# EAGLE design sensorfly_sensors (EAGLE 5.11)

## Sheet 1 of 2
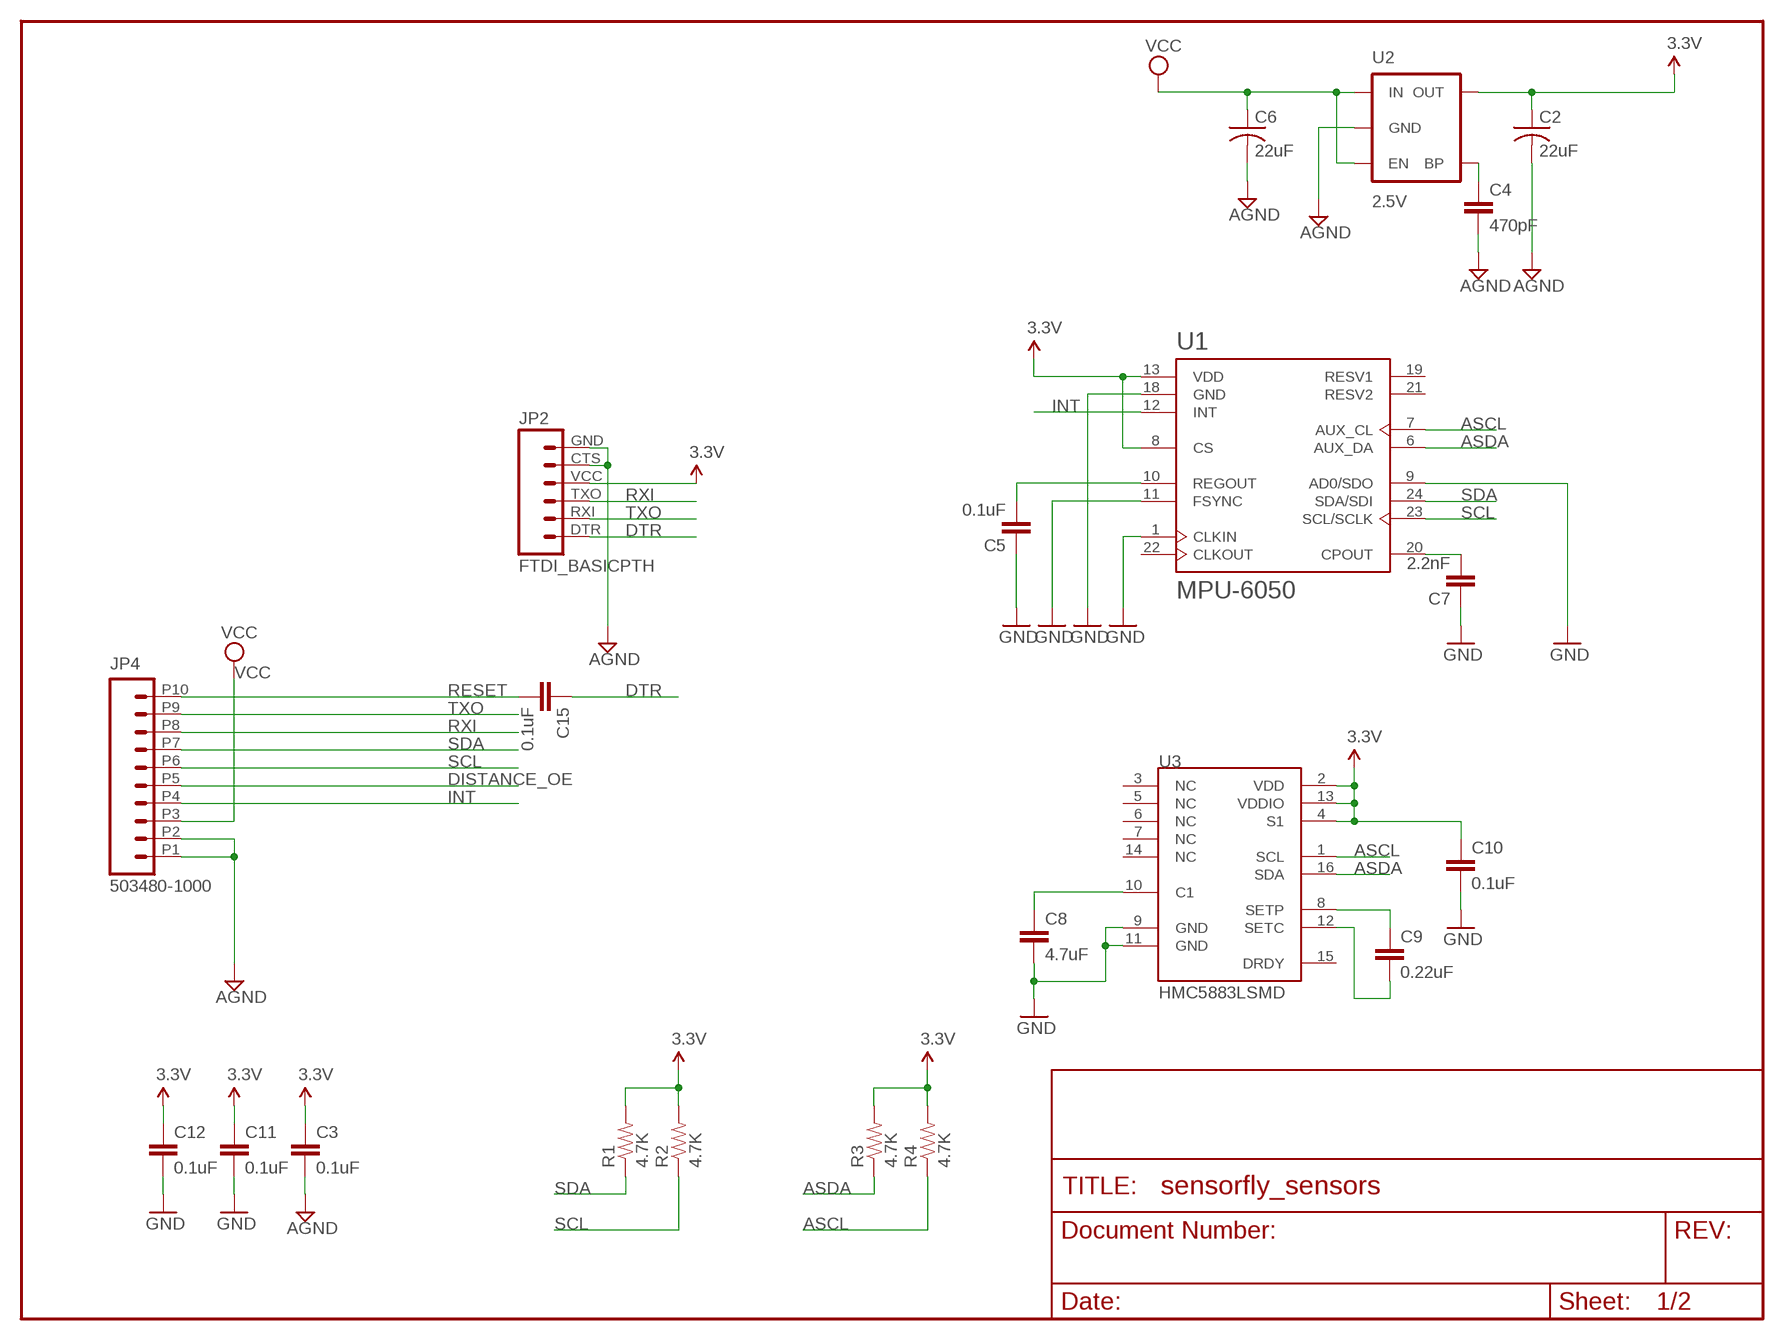
[diagram p0: schematic, sheet 1]

### Parts
C2  22uF  C-USC0805  [C0805]
C3  0.1uF  CAP0402-CAP  [0402-CAP]
C4  470pF  CAP0402-CAP  [0402-CAP]
C5  0.1uF  CAP0402-CAP  [0402-CAP]
C6  22uF  C-USC0805  [C0805]
C7  2.2nF  CAP0402-CAP  [0402-CAP]
C8  4.7uF  CAP0805  [0805]
C9  0.22uF  CAP0402-CAP  [0402-CAP]
C10  0.1uF  CAP0402-CAP  [0402-CAP]
C11  0.1uF  CAP0402-CAP  [0402-CAP]
C12  0.1uF  CAP0402-CAP  [0402-CAP]
C15  0.1uF  CAP0402-CAP  [0402-CAP]
JP2  FTDI_BASICPTH  [FTDI_BASIC]
JP4  503480-1000  [503480-1000]
R1  4.7K  RESISTOR0402-RES  [0402-RES]
R2  4.7K  RESISTOR0402-RES  [0402-RES]
R3  4.7K  RESISTOR0402-RES  [0402-RES]
R4  4.7K  RESISTOR0402-RES  [0402-RES]
U1  MPU-6050  MPU-6000  [QFN24MPU]
U2  2.5V  V_REG_LDOSMD  [SOT23-5]
U3  HMC5883LSMD  [16LPCC]

### Nets
3.3V: C2.1 C3.1 C10.1 C11.1 C12.1 JP2.VCC R1.2 R2.2 R3.2 R4.2 U1.8(CS) U1.13(VDD) U2.5(OUT) U3.2(VDD) U3.4(S1) U3.13(VDDIO) ; also sheet 2
AGND: C2.2 C3.2 C4.2 C6.2 JP2.CTS JP2.GND JP4.P1 JP4.P2 U2.2(GND) ; also sheet 2
ASCL: R4.1 U1.7(AUX_CL) U3.1(SCL)
ASDA: R3.1 U1.6(AUX_DA) U3.16(SDA)
DISTANCE_OE: JP4.P5 ; also sheet 2
DTR: C15.1 JP2.DTR
GND: C5.1 C7.1 C8.2 C10.2 C11.2 C12.2 U1.1(CLKIN) U1.9(AD0/SDO) U1.11(FSYNC) U1.18(GND) U3.9(GND) U3.11(GND)
INT: JP4.P4 U1.12(INT)
N$2: C4.1 U2.4(BP)
N$29: C7.2 U1.20(CPOUT)
N$30: C5.2 U1.10(REGOUT)
N$31: C8.1 U3.10(C1)
N$37: C9.1 U3.8(SETP)
N$38: C9.2 U3.12(SETC)
RESET: C15.2 JP4.P10
RXI: JP2.TXO JP4.P8 ; also sheet 2
SCL: JP4.P6 R2.1 U1.23(SCL/SCLK)
SDA: JP4.P7 R1.1 U1.24(SDA/SDI)
TXO: JP2.RXI JP4.P9 ; also sheet 2
VCC: C6.1 JP4.P3 U2.1(IN) U2.3(EN) ; also sheet 2
Unconnected: U1.19(RESV1) U1.21(RESV2) U1.22(CLKOUT) U3.3(NC) U3.5(NC) U3.6(NC) U3.7(NC) U3.14(NC) U3.15(DRDY)

## Sheet 2 of 2
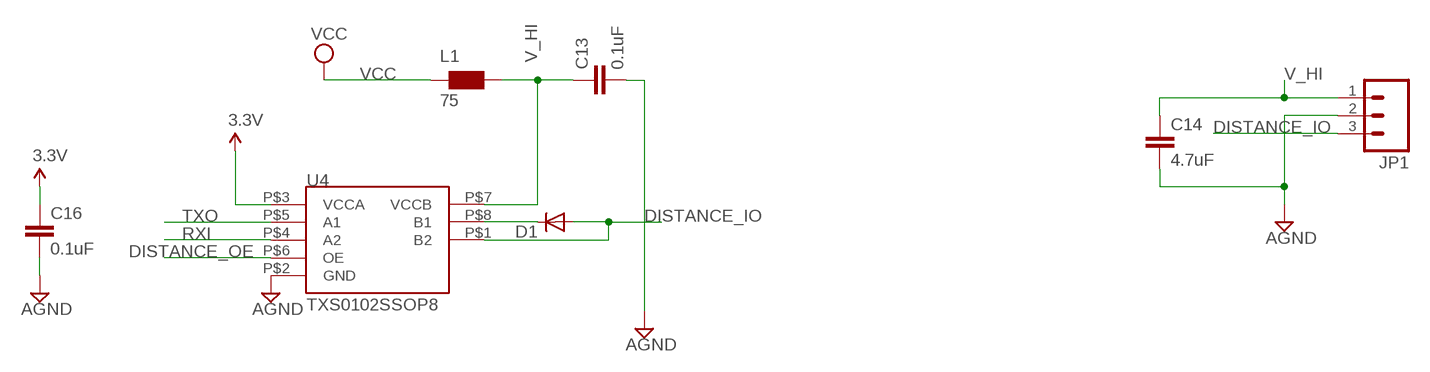
[diagram p1: schematic, sheet 2]

### Parts
C13  0.1uF  CAP0402-CAP  [0402-CAP]
C14  4.7uF  CAP0805  [0805]
C16  0.1uF  CAP0402-CAP  [0402-CAP]
D1  DIODESOD  [SOD-323]
JP1  M03PTH  [1X03]
L1  75  WE-KIHQ_0805  [WE-KI_0805_B]
U4  TXS0102SSOP8  [SSOP8]

### Nets
3.3V: C16.1 U4.P$3(VCCA) ; also sheet 1
AGND: C13.2 C14.2 C16.2 JP1.2 U4.P$2(GND) ; also sheet 1
DISTANCE_IO: D1.2(A) JP1.3 U4.P$1(B2)
DISTANCE_OE: U4.P$6(OE) ; also sheet 1
N$4: D1.1(C) U4.P$8(B1)
RXI: U4.P$4(A2) ; also sheet 1
TXO: U4.P$5(A1) ; also sheet 1
V_HI: C13.1 C14.1 JP1.1 L1.1 U4.P$7(VCCB)
VCC: L1.2 ; also sheet 1

## Library data of the parts
C2 C6 = rcl:C-US: CAPACITOR, American symbol
C3-C5 C7-C16 = SparkFun:CAP: Capacitor Standard 0603 ceramic capacitor, and 0.1" leaded capacitor.
D1 = SparkFun:DIODE: Diode These are standard reverse protection diodes and small signal diodes. SMA package can handle up to about 1A. SOD-323 can handle about 200mA. What the SOD-323 package when ordering, there are some mfgs out there that are 5-pin packages.
JP1 = SparkFun:M03: Header 3 Standard 3-pin 0.1" header. Use with straight break away headers (SKU : PRT-00116), right angle break away headers (PRT-00553), swiss pins (PRT-00743), machine pins (PRT-00117), and female headers (PRT-00115). Molex polarized connector foot print use with SKU : PRT-08232 with associated crimp pins and housings.
JP2 = SparkFun:FTDI_BASIC: FTDI Basic: 3.3V and 5V
JP4 = pei:503480-1000
L1 = wuerth-elektronik:WE-KIHQ: SMD Wire Wound Ceramic Inductor WE-KIHQ - High current - Highest Quality factor in size 0805 - up to 98 - High thermal stability - High SRF -- Bluetooth -- Wireless LAN -- RF oscillation circuit -- IF impedance matching -- IG choke
R1-R4 = SparkFun:RESISTOR: Resistor Basic schematic elements and footprints for 0603, 1206, and PTH resistors.
U1 = sf-invensense:MPU-6000
U2 = SparkFun:V_REG_LDO: Voltage Regulator LDO Standard 150mA LDO voltage regulator in SOT-23 layout. Micrel part MIC5205. BP (by-pass) pin is used to lower output noise with 470pF cap.
U3 = SparkFun:HMC5883L: 3 Axis Digital Compass IC
U4 = pei:TXS0102

## Net classes
0 default: width 0.152 mm, drill 0.152 mm, clearance 0.152 mm
1 power: width 0.254 mm, drill 0.305 mm, clearance 0.152 mm

## Board
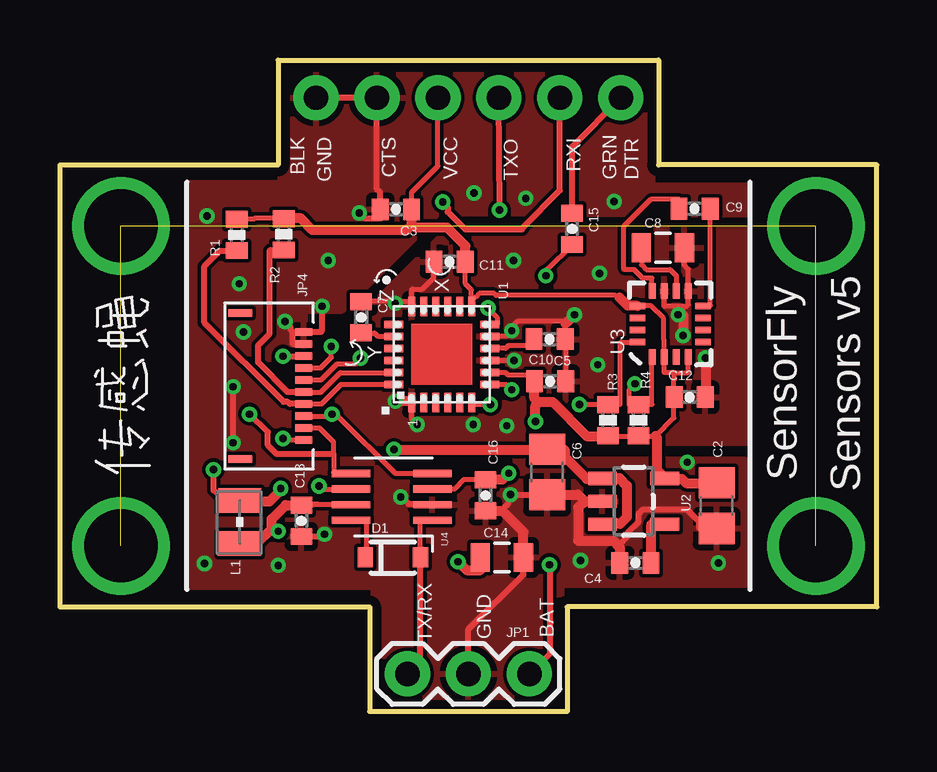
[diagram p2: board, top side]
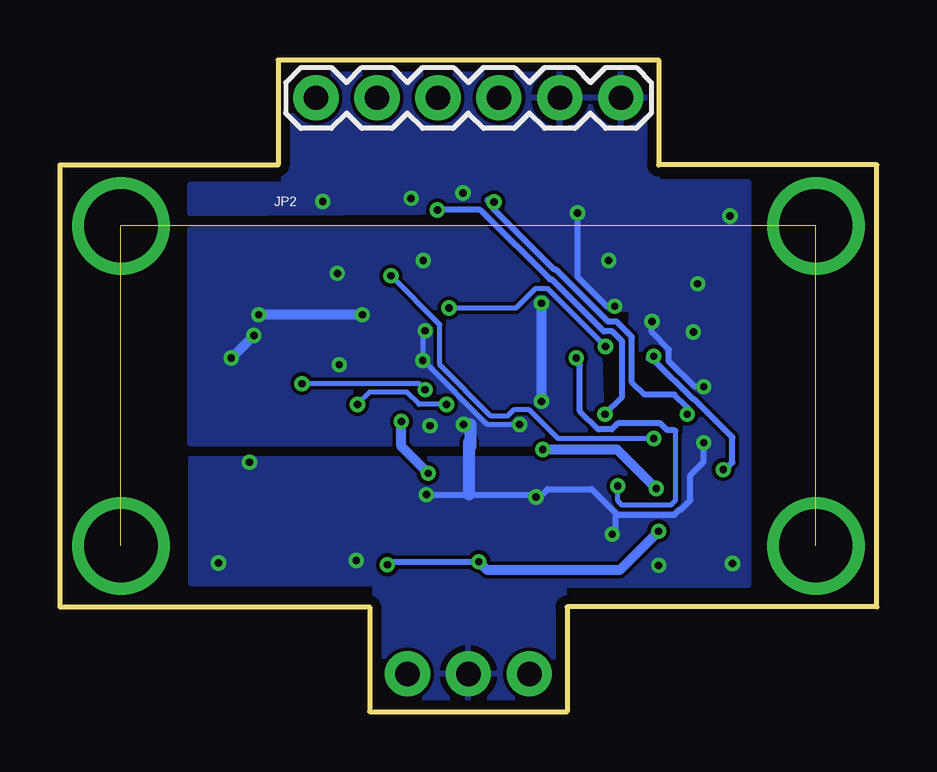
[diagram p3: board, bottom side, seen from below]

Size 34.04 x 27.15 mm. Coordinates in mm from the lower left corner, seen from the top.
Outline: 0,4.37 0,22.78 9.09,22.78 9.09,27.15 24.94,27.15 24.94,22.78 34.04,22.78 34.04,4.37 21.13,4.37 21.13,0 12.9,0 12.9,4.37 0,4.37
Copper layers (1*2+15*16): Top 0.0356mm / dielectric 1.5011mm / Route2 0.0356mm / dielectric 0.1499mm / Route15 0.0356mm / dielectric 0.2007mm / Bottom 0.0356mm
Design rules "typical_4pcb *": minimum track width 5mil, minimum drill 6mil, track to track 6mil, track to pad 6mil, pad to pad 7mil, via to via 7mil, smd to smd 6mil, copper to edge 15mil, drill to drill 8mil, minimum pad ring 10mil, minimum via ring 5mil, stop-mask expansion 4mil, vias tented up to drill 12mil, thermal gap 10mil

### Footprints (pad centres in the part's own frame; a part is rotated, then mirrored left to right if it is on the bottom)
C0805 = smd 1.3 x 1.5: 1 -0.95,0; 2 0.95,0
0402-CAP = smd 0.7 x 0.9: 1 -0.65,0; 2 0.65,0
0805 = smd 0.8 x 1.2: 1 -0.9,0; 2 0.9,0
SOD-323 = smd 0.63 x 0.83: 1 -1.15,0; 2 1.15,0
1X03 = drill 1.016 pad 1.88 round: 1 0,0; 2 2.54,0; 3 5.08,0
FTDI_BASIC = drill 1.016 pad 1.88 round: CTS 10.16,0; DTR 0,0; GND 12.7,0; RXI 2.54,0; TXO 5.08,0; VCC 7.62,0
503480-1000 = smd 0.3 x 0.7: P1 -2,0; P2 -1.5,0; P3 -1,0; P4 -0.5,0; P5 0,0; P6 0.5,0; P7 1,0; P8 1.5,0; P9 2,0; P10 2.5,0 | smd 0.3 x 1: P$11 -2.79,-2.65; P$12 3.29,-2.65
WE-KI_0805_B = smd 1.02 x 1.78: 1 -0.89,0; 2 0.89,0
0402-RES = smd 0.7 x 0.9: 1 -0.65,0; 2 0.65,0
QFN24MPU = smd 0.8 x 0.3: 1 -2,1.25; 2 -2,0.75; 3 -2,0.25; 4 -2,-0.25; 5 -2,-0.75; 6 -2,-1.25; 13 2,-1.25; 14 2,-0.75; 15 2,-0.25; 16 2,0.25; 17 2,0.75; 18 2,1.25 | smd 0.3 x 0.8: 7 -1.25,-2; 8 -0.75,-2; 9 -0.25,-2; 10 0.25,-2; 11 0.75,-2; 12 1.25,-2; 19 1.25,2; 20 0.75,2; 21 0.25,2; 22 -0.25,2; 23 -0.75,2; 24 -1.25,2
SOT23-5 = smd 0.55 x 1.2: 1 -0.95,-1.3; 2 0,-1.3; 3 0.95,-1.3; 4 0.95,1.3; 5 -0.95,1.3
16LPCC = smd 0.65 x 0.28: 1 -1.37,0.75; 2 -1.37,0.25; 3 -1.37,-0.25; 4 -1.37,-0.75; 9 1.37,-0.75; 10 1.37,-0.25; 11 1.37,0.25; 12 1.37,0.75 | smd 0.28 x 0.65: 5 -0.75,-1.37; 6 -0.25,-1.37; 7 0.25,-1.37; 8 0.75,-1.37; 13 0.75,1.37; 14 0.25,1.37; 15 -0.25,1.37; 16 -0.75,1.37
SSOP8 = smd 0.3 x 1.6: P$1 0,0; P$2 0.65,0; P$3 1.3,0; P$4 1.95,0; P$5 1.95,3.4; P$6 1.3,3.4; P$7 0.65,3.4; P$8 0,3.4

### Placement (x,y rotation side)
C2  27.36,8.59 270 top
C3  14,20.93 180 top
C4  23.98,6.2 180 top
C5  20.4,15.52 180 top
C6  20.29,9.98 270 top
C7  12.55,16.43 270 top
C8  25.12,19.33 0 top
C9  26.44,20.95 180 top
C10  20.42,13.77 0 top
C11  16.23,18.75 180 top
C12  26.24,13.11 0 top
C13  10.06,7.95 270 top
C14  18.41,6.43 0 top
C15  21.34,20.12 270 top
C16  17.73,9.02 270 top
D1  13.87,6.43 0 top
JP1  19.56,1.57 180 top
JP2  23.37,25.58 0 bottom
JP4  10.16,13.82 270 top
L1  7.49,7.9 90 top
R1  7.37,19.86 90 top
R2  9.32,19.89 90 top
R3  22.83,12.14 270 top
R4  24.1,12.14 270 top
U1  15.9,14.88 90 top
U2  23.9,8.76 270 top
U3  25.43,16.15 90 top
U4  15.52,7.98 90 top
U$2  [SENSORFLY_SMALLER]  2.54,13.72 90 top

### Tracks (layer width: path | path; a pad name or v marks a point on that pad's centre or on a via)
3.3V  (via drill 0.3 pad 0.64)
  Top 0.203: U1.8 17.91,14.12 18.57,14.12 18.67,14.02 19.77,14.02 C10.1 | C11.1 16.89,17.83 17.15,17.58 U1.13 17.22,17.25 17.32,17.27 17.48,17.42 18.09,17.42 18.16,17.35 23.14,17.35 23.32,17.25 | 25.6,14.12 25.2,14.12 25.17,14.15 U3.2 25.17,14.88 25.17,15.49 25.15,15.52 25.15,16.38 24.61,16.92 24.08,16.92 U3.13 | 25.6,14.12 26.16,14.12 26.19,14.15 U3.4 | 25.6,14.12 25.6,13.84 25.58,13.82 25.58,13.11 C12.1 25.58,13.03 25.58,12.24 24.82,11.48 R4.2 24.03,11.48 R3.2 | C16.1 16.84,9.68 16.46,9.3 16.26,9.3 16.23,9.27 U4.P$3 | R2.2 8.1,20.55 8.08,20.52 7.37,20.52 R1.2 | JP2.VCC 15.75,22.73 14.66,21.64 14.66,21.11 C3.1
  Top 0.406: C2.1 27.36,9.52 26.09,9.52 25.91,9.7 25.22,9.7 U2.5 25.07,9.88 24.87,10.08 24.87,11.4 24.82,11.48 | 19.91,12.9 20.52,12.9 21.95,11.48 22.76,11.48 R3.2 | 19.91,12.9 19.76,13.06 19.76,13.69 C10.1 | v19.81,12.09 19.81,12.73 19.91,12.9 | v18.69,9.93 18.44,9.68 17.8,9.68 C16.1 | 14.66,20.27 C3.1 | 14.66,20.27 14.45,20.07 10.52,20.07 10.03,20.55 9.4,20.55 R2.2 | C11.1 16.89,18.82 16.89,19.41 16.13,20.17 14.83,20.17 14.66,20.27 | 23.32,17.25 23.65,16.92 23.98,16.92 U3.13
  Bottom 0.406: v19.81,12.09 19.81,11.05 v18.69,9.93
AGND  (via drill 0.3 pad 0.64)
  Top 0.254: 9.68,15.82 JP4.P1 10.26,15.82 10.87,15.82 10.92,15.87 v10.92,16.89 | 9.68,15.82 9.68,15.34 9.7,15.32 JP4.P2 | C6.2 20.12,9.04 v18.77,9.04 18.69,8.94 18.69,8.69 18.54,8.53 18.44,8.36 | v11.02,7.39 10.87,7.39 10.77,7.29 C13.2 | v14.2,8.94 14.25,8.94 14.53,8.66 14.78,8.66 14.81,8.64 U4.P$2 | 17.8,8.36 17.73,8.36 C16.2 | 23.25,6.92 23.67,7.34 23.67,7.47 24.11,7.9 24.11,8.25 24.28,8.43 26.11,8.43 26.62,7.92 26.62,7.67 26.65,7.65 C2.2 | v12.47,20.78 12.7,20.55 13.34,20.55 13.34,20.93 C3.2 13.34,21.03 13.34,21.64 13.21,21.77 JP2.CTS JP2.GND | v9.37,16.26 9.6,16.03 9.6,15.93 9.68,15.82 | v7.21,11.2 v7.21,13.54 | JP1.2 17.02,3.43 19.3,5.71 19.3,6.25 C14.2
  Top 0.406: 21.86,8.78 21.59,9.04 20.3,9.04 C6.2 | 21.86,8.78 21.87,8.76 U2.2 | C4.2 23.32,6.2 23.32,6.86 23.25,6.92 23.06,7.11 21.62,7.11 21.59,7.14 21.59,8.51 21.86,8.78 | 17.8,8.36 18.44,8.36 19.3,7.49 C14.2
  Bottom 0.254: 14.2,9.04 13.95,9.04 13.72,9.27 11.89,9.27 10.82,8.2 | v18.77,9.04 16.99,9.04 14.2,9.04 | 10.82,8.2 8.43,8.2 8.23,8.41 8.18,8.41 7.77,8.81 7.77,9.83 7.7,9.93 7.21,10.41 v7.21,11.2 | v11.02,7.39 10.9,7.52 10.9,8.1 10.82,8.2 | 14.2,9.04 v14.2,8.94 | v12.47,20.78 12.47,18.11 11.25,16.89 v10.92,16.89 | v9.37,16.26 9.37,15.8 8.66,15.09 8.66,14.6 7.59,13.54 v7.21,13.54
  Bottom 0.508: 16.99,9.04 16.99,11.23
  other vias: 7.65,15.82 7.47,17.83 6.12,20.65 11.18,18.8 23.09,21.26 19.41,21.39 17.25,21.62 9.09,6.1 6.02,6.17 21.69,6.3 27.43,6.2 26.14,10.39
  pour Top: 5.36,22.02 5.36,5.21 13.06,5.21 13.06,0.2 20.9,0.2 20.9,5.28 28.58,5.28 28.58,10.49 10.29,10.49 10.29,13.51 10.21,16.71 11.76,16.71 15.44,20.4 15.75,20.78 28.6,20.7 28.6,21.92 24.69,21.92 24.69,27.05 9.17,27.05 9.17,22.02
  pour Bottom: 5.36,22.07 5.36,5.26 13.06,5.26 13.06,0.25 20.9,0.25 20.9,5.33 28.58,5.33 28.58,10.54 10.29,10.54 10.29,13.56 10.21,16.76 11.76,16.76 15.44,20.45 15.75,20.83 28.6,20.75 28.6,21.97 24.69,21.97 24.69,27.1 9.17,27.1 9.17,22.07
ASCL  (via drill 0.3 pad 0.64)
  Top 0.203: U3.1 24.66,14.78 24.66,12.8 24.11,12.8 R4.1 24.03,12.8 23.7,12.8 23.7,13.41 v23.95,13.66 | v18.82,13.41 18.59,13.64 U1.7
  Bottom 0.203: v23.95,13.66 19.08,13.66 v18.82,13.41
ASDA  (via drill 0.3 pad 0.64)
  Top 0.203: U3.16 24.05,15.39 23.37,15.39 23.34,15.37 23.34,12.8 22.84,12.8 R3.1 22.76,12.8 v21.64,12.8 | v17.93,12.8 17.15,12.8 U1.6
  Bottom 0.203: v21.64,12.8 21.13,13.31 19.58,13.31 19.08,12.8 v17.93,12.8
DISTANCE_IO
  Top 0.203: U4.P$1 15.01,7.98 15.01,6.86 15.04,6.83 15.04,6.12 D1.2
  Top 0.254: JP1.3 15.01,2.11 15.01,6.02 D1.2
DISTANCE_OE  (via drill 0.3 pad 0.64)
  Top 0.203: JP4.P5 10.87,13.82 11.53,14.48 12.32,14.48 12.52,14.68 v12.52,14.73 | v10.8,9.4 10.92,9.27 U4.P$6
  Bottom 0.203: 12.52,14.58 v12.52,14.73 12.45,14.53 | 8.38,11.68 8.38,8.79 8.46,8.74 8.59,8.61 10.64,8.61 10.69,8.69 10.8,8.79 v10.8,9.4
  Bottom 0.254: 8.38,11.68 8.46,11.73 8.74,11.73 9.02,12.01 10.8,12.01 11.05,11.76 11.61,11.76 12.37,12.52 12.37,14.45 v12.52,14.73
DTR
  Top 0.254: C15.1 21.34,23.55 JP2.DTR
GND  (via drill 0.3 pad 0.64)
  Top 0.203: v18.92,14.63 U1.9 | C10.2 21.07,15.52 C5.1 21.06,15.6 21.06,16.18 20.95,16.28 19.1,16.28 18.76,15.94 | 18.76,15.94 18.62,15.8 18.62,15.67 18.59,15.65 U1.11 | C11.2 15.57,18.08 15.09,17.6 14.68,17.6 14.66,17.58 U1.18 14.58,17.09 13.97,17.09 12.55,17.09 C7.1 | C8.2 26.01,18.62 26.19,18.44 U3.9 26.19,17.42 26.19,16.97 26.11,16.89 25.96,16.89 | 25.96,16.89 25.2,16.89 25.17,16.92 25.17,17.5 U3.11 | 25.96,16.54 25.96,16.89 | v14.88,11.96 14.66,12.19 U1.1 14.55,12.93 | v18.82,15.87 18.76,15.94
  Top 0.406: v26.9,14.73 C12.2 | v25.96,15.67 25.96,16.54 v25.76,16.54 | v21.44,16.54 21.13,16.23 21.06,16.18 | 14.55,12.93 v13.97,12.93 | v13.97,17.02 13.97,17.09
  Bottom 0.203: v18.92,14.63 18.97,14.63 | v14.88,11.96 16.23,11.96 18.85,14.58 v18.92,14.63 | v18.82,15.87 18.9,15.8 18.9,14.73 v18.92,14.63
  Bottom 0.406: v25.96,15.67 v26.9,14.73 | v21.44,16.54 v25.76,16.54 | v13.97,12.93 v13.97,17.02
  Bottom 0.508: v17.22,11.96 16.94,11.96 16.94,11.05
  other vias: 18.62,11.91 22.4,14.45 22.48,18.26 18.9,18.8
  pour Bottom: 11.56,15.49 16.15,20.09 28.63,20.09 28.63,11.18 11.43,11.18
  pour Top: 11.56,15.49 16.15,20.09 28.63,20.09 28.63,11.18 11.43,11.18
INT  (via drill 0.3 pad 0.64)
  Top 0.203: v17.83,16.81 18.21,16.43 18.21,16.13 U1.12 | v11.3,15.21 11.3,14.76 10.87,14.33 JP4.P4
  Bottom 0.203: v17.83,16.81 15.04,16.81 14.22,17.63 13.72,17.63 v11.3,15.21
N$1  (via drill 3.05 pad 0.89)  (3 unrouted)
  other vias: 2.54,20.24 2.54,6.91 31.5,6.91 31.5,20.24
N$2
  Top 0.406: C4.1 24.64,7.8 24.66,7.82 25.2,7.82 U2.4
N$4
  Top 0.203: U4.P$8 12.75,7.98 12.78,7.95 12.78,6.86 12.75,6.83 12.75,6.12 D1.1
N$29
  Top 0.203: U1.20 13.23,15.65 13.11,15.77 C7.2
N$30
  Top 0.203: U1.10 18.57,15.14 18.67,15.24 19.47,15.24 C5.2
N$31
  Top 0.203: U3.10 25.68,18.16 25.42,18.41 24.44,18.41 24.23,18.62 24.23,19.33 C8.1
N$37
  Top 0.203: C9.1 27.1,20.95 27.1,16.92 U3.8
N$38
  Top 0.203: U3.12 24.66,17.53 24.66,18.06 24.28,18.06 23.93,18.41 23.52,18.41 23.49,18.44 23.49,20.22 24.64,21.36 25.78,21.36 C9.2
RESET  (via drill 0.3 pad 0.64)
  Top 0.203: v20.24,18.16 20.3,18.44 21.34,19.46 C15.2 | v9.3,11.38 9.4,11.38 9.45,11.33 JP4.P10
  Bottom 0.203: v20.24,18.16 18.21,16.13 18.21,14.45 16.08,12.32 15.39,12.32 15.14,12.57 14.48,12.57 13.28,11.38 v9.3,11.38
RXI  (via drill 0.3 pad 0.64)
  Top 0.203: JP4.P8 11.33,12.32 11.58,12.32 13.97,9.93 U4.P$4
  Top 0.254: 11.33,12.32 v11.33,12.39 | v18.31,20.9 JP2.TXO
  Bottom 0.254: v11.33,12.39 10.62,13.11 10.62,15.44 11.02,15.85 11.38,15.85 13.54,18.01 13.61,18.01 16.43,20.83 16.54,20.9 v18.31,20.9
SCL
  Top 0.203: U1.23 13.89,14.12 11.68,14.12 10.87,13.31 JP4.P6 10.08,13.31 | 9.42,19.23 R2.1
  Top 0.254: JP4.P6 9.98,13.31 9.5,13.31 8.25,14.55 8.25,15.27 8.74,15.75 8.74,19.2 8.76,19.23 9.25,19.23 R2.1
SDA
  Top 0.203: U1.24 11.71,13.64 10.9,12.83 JP4.P7
  Top 0.254: JP4.P7 10.08,12.83 9.58,12.83 9.5,12.9 9.32,12.9 6.02,16.2 6.02,18.57 6.66,19.2 R1.1
TXO  (via drill 0.3 pad 0.64)
  Top 0.203: JP4.P9 10.82,11.81 11.41,11.23 11.41,10.74 11.41,9.96 11.43,9.93 U4.P$5
  Top 0.254: v7.9,12.39 8.66,11.66 8.66,11.1 9.02,10.74 11.41,10.74 | 16.08,21.13 15.98,21.23 v15.95,21.23 16.15,21.03 16.15,20.83 16.89,20.09 19.25,20.09 19.3,20.19 20.83,21.72 JP2.RXI
  Bottom 0.254: v7.9,12.39 7.9,12.67 8.43,13.21 9.68,13.21 10.21,13.72 10.21,15.62 10.85,16.26 11.2,16.26 13.36,18.41 13.44,18.41 16,20.98 16,21.01 v15.95,21.23 16.06,21.12 16.2,21.26 16.2,21.34
V_HI  (via drill 0.3 pad 0.64)
  Top 0.203: 10.77,8.64 U4.P$7 | 10.77,8.64 10.19,8.64 | 10.77,8.64 10.06,8.56 C13.1
  Top 0.254: JP1.1 20.4,2.41 v20.4,6.12
  Top 0.406: 8.81,7.62 8.81,8.03 9.4,8.61 9.98,8.61 C13.1 | 8.81,7.62 8.2,7.01 L1.1 | v9.09,7.52 8.99,7.52 8.81,7.62 | v16.59,6.25 16.94,5.89 17.53,5.89 C14.1
  Bottom 0.254: v16.59,6.25 16.76,6.22 20.4,6.22 v20.4,6.12
  Bottom 0.406: v9.09,7.52 10.72,5.89 16.23,5.89 v16.59,6.25
VCC  (via drill 0.3 pad 0.64)
  Top 0.254: v9.3,14.81 10.16,14.81 JP4.P3 | v6.4,10.08 6.4,9.22 6.83,8.79 7.32,8.79 L1.2
  Top 0.406: U2.3 22.61,7.82 23.34,7.82 23.62,8.1 23.62,9.42 23.32,9.73 23.29,9.7 22.81,9.7 U2.1 22.58,9.7 21.95,9.7 21.03,10.62 21.03,10.9 21.01,10.92 C6.1 20.12,10.92 v13.92,10.92 | v9.2,9.3 9.2,9.22 8.74,8.76 8.23,8.76 8.2,8.79 L1.2
  Bottom 0.254: v9.3,14.81 9.45,14.81 | 6.25,10.19 6.32,10.19 v6.4,10.08 6.15,10.26 6.02,10.39 6.02,11.43 7.62,13.03 7.67,13.03 9.27,14.63 9.27,14.68 v9.3,14.81 | v9.3,14.81 9.52,14.71
  Bottom 0.406: v13.92,10.92 10.82,10.92 v9.2,9.3

### Text on the board
tPlace: GND | CTS | VCC | TXO | RXI | DTR | BLK | GRN | SensorFly | Sensors v5 | TX/RX | GND | BAT